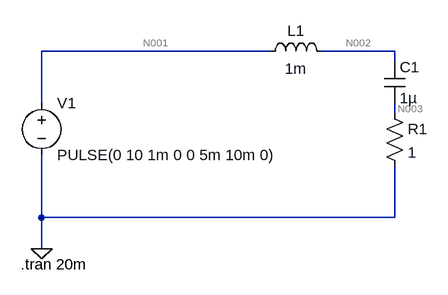
[diagram p0: schematic rc_v3.asc]
rc_v3.asc, the LTspice schematic file:
Version 4.1
SHEET 1 880 680
WIRE 304 64 -48 64
WIRE 496 64 384 64
WIRE 496 80 496 64
WIRE -48 144 -48 64
WIRE 496 160 496 144
WIRE -48 320 -48 224
WIRE 496 320 496 240
WIRE 496 320 -48 320
WIRE -48 368 -48 320
FLAG -48 368 0
SYMBOL voltage -48 128 R0
WINDOW 123 0 0 Left 0
WINDOW 39 0 0 Left 0
SYMATTR InstName V1
SYMATTR Value PULSE(0 10 1m 0 0 5m 10m 0)
SYMBOL res 480 144 R0
SYMATTR InstName R1
SYMATTR Value 1
SYMBOL ind 288 80 R270
WINDOW 0 32 56 VTop 2
WINDOW 3 5 56 VBottom 2
SYMATTR InstName L1
SYMATTR Value 1m
SYMBOL cap 480 80 R0
SYMATTR InstName C1
SYMATTR Value 1µ
TEXT -80 392 Left 2 !.tran 20m

The netlist it stands for:
* rc_v3.asc
V1 N001 0 PULSE(0 10 1m 0 0 5m 10m 0)
R1 N003 0 1
L1 N001 N002 1m
C1 N002 N003 1µ
.tran 20m
.backanno
.end

* Results of the author's LTspice run, read from the files saved beside the schematic
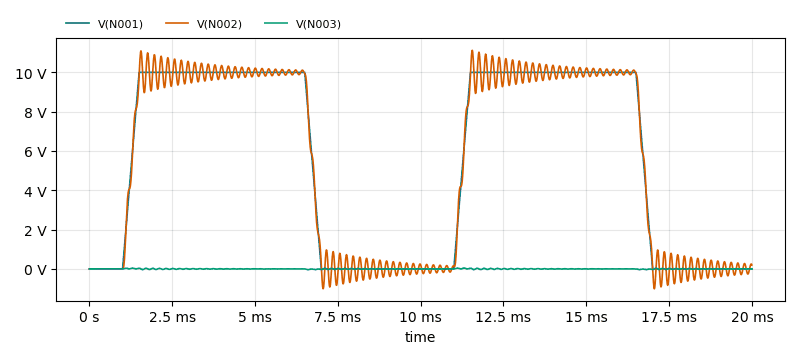
[diagram p1: Transient Analysis of rc_v3.asc, plotted from the saved traces]
* Transient Analysis, 1 run:
*   V(N001): min 0 V, max 10 V, average 5.5 V, rms 7.303 V, last 0 V
*   V(N002): min -1.012 V, max 11.12 V, average 5.5 V, rms 7.318 V, last 200.7 mV
*   V(N003): min -36.52 mV, max 41.04 mV, average 10.26 µV, rms 13.24 mV, last -4.456 mV